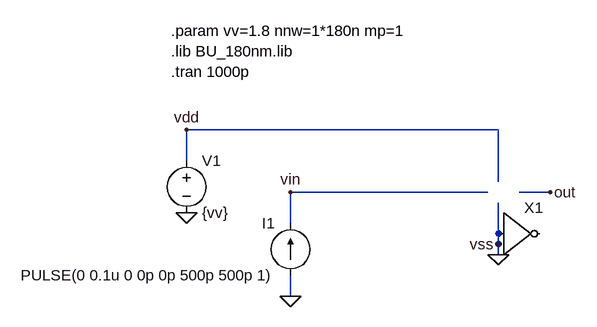
[diagram p0: schematic inv_capacity.asc]
inv_capacity.asc, the LTspice schematic file:
Version 4
SHEET 1 1168 680
WIRE 416 224 -64 224
WIRE -64 272 -64 224
WIRE 416 304 416 224
WIRE 400 320 96 320
WIRE 496 320 448 320
WIRE 96 368 96 320
WIRE 416 400 416 336
WIRE 416 416 416 400
WIRE 96 480 96 448
FLAG -64 352 0
FLAG 96 480 0
FLAG 416 416 0
FLAG -64 224 vdd
FLAG 416 400 vss
FLAG 96 320 vin
FLAG 496 320 out
SYMBOL /voltage -64 256 R0
SYMATTR InstName V1
SYMATTR Value {vv}
SYMBOL inv 416 320 R0
SYMATTR InstName X1
SYMATTR SpiceLine ll=180n wn={nnw} wp={nnw*mp}
SYMBOL /current 96 448 R180
WINDOW 0 24 80 Left 2
WINDOW 3 24 0 Left 2
SYMATTR InstName I1
SYMATTR Value PULSE(0 0.1u 0 0p 0p 500p 500p 1)
TEXT -88 72 Left 2 !.param vv=1.8 nnw=1*180n mp=1\n.lib BU_180nm.lib\n.tran 1000p

The netlist it stands for:
* inv_capacity.asc
V1 vdd 0 {vv}
A§X1 0 0 0 0 0 0 0 0 BUF ll=180n wn={nnw} wp={nnw*mp}
I1 0 vin PULSE(0 0.1u 0 0p 0p 500p 500p 1)
.param vv=1.8 nnw=1*180n mp=1
.lib BU_180nm.lib
.tran 1000p
.backanno
.end